# EAGLE design 00C-001 (EAGLE 6.3)
CIRCUIT_CATEGORY: CATEGORY; CIRCUIT_NAME: NAME

## Sheet 1 of 4
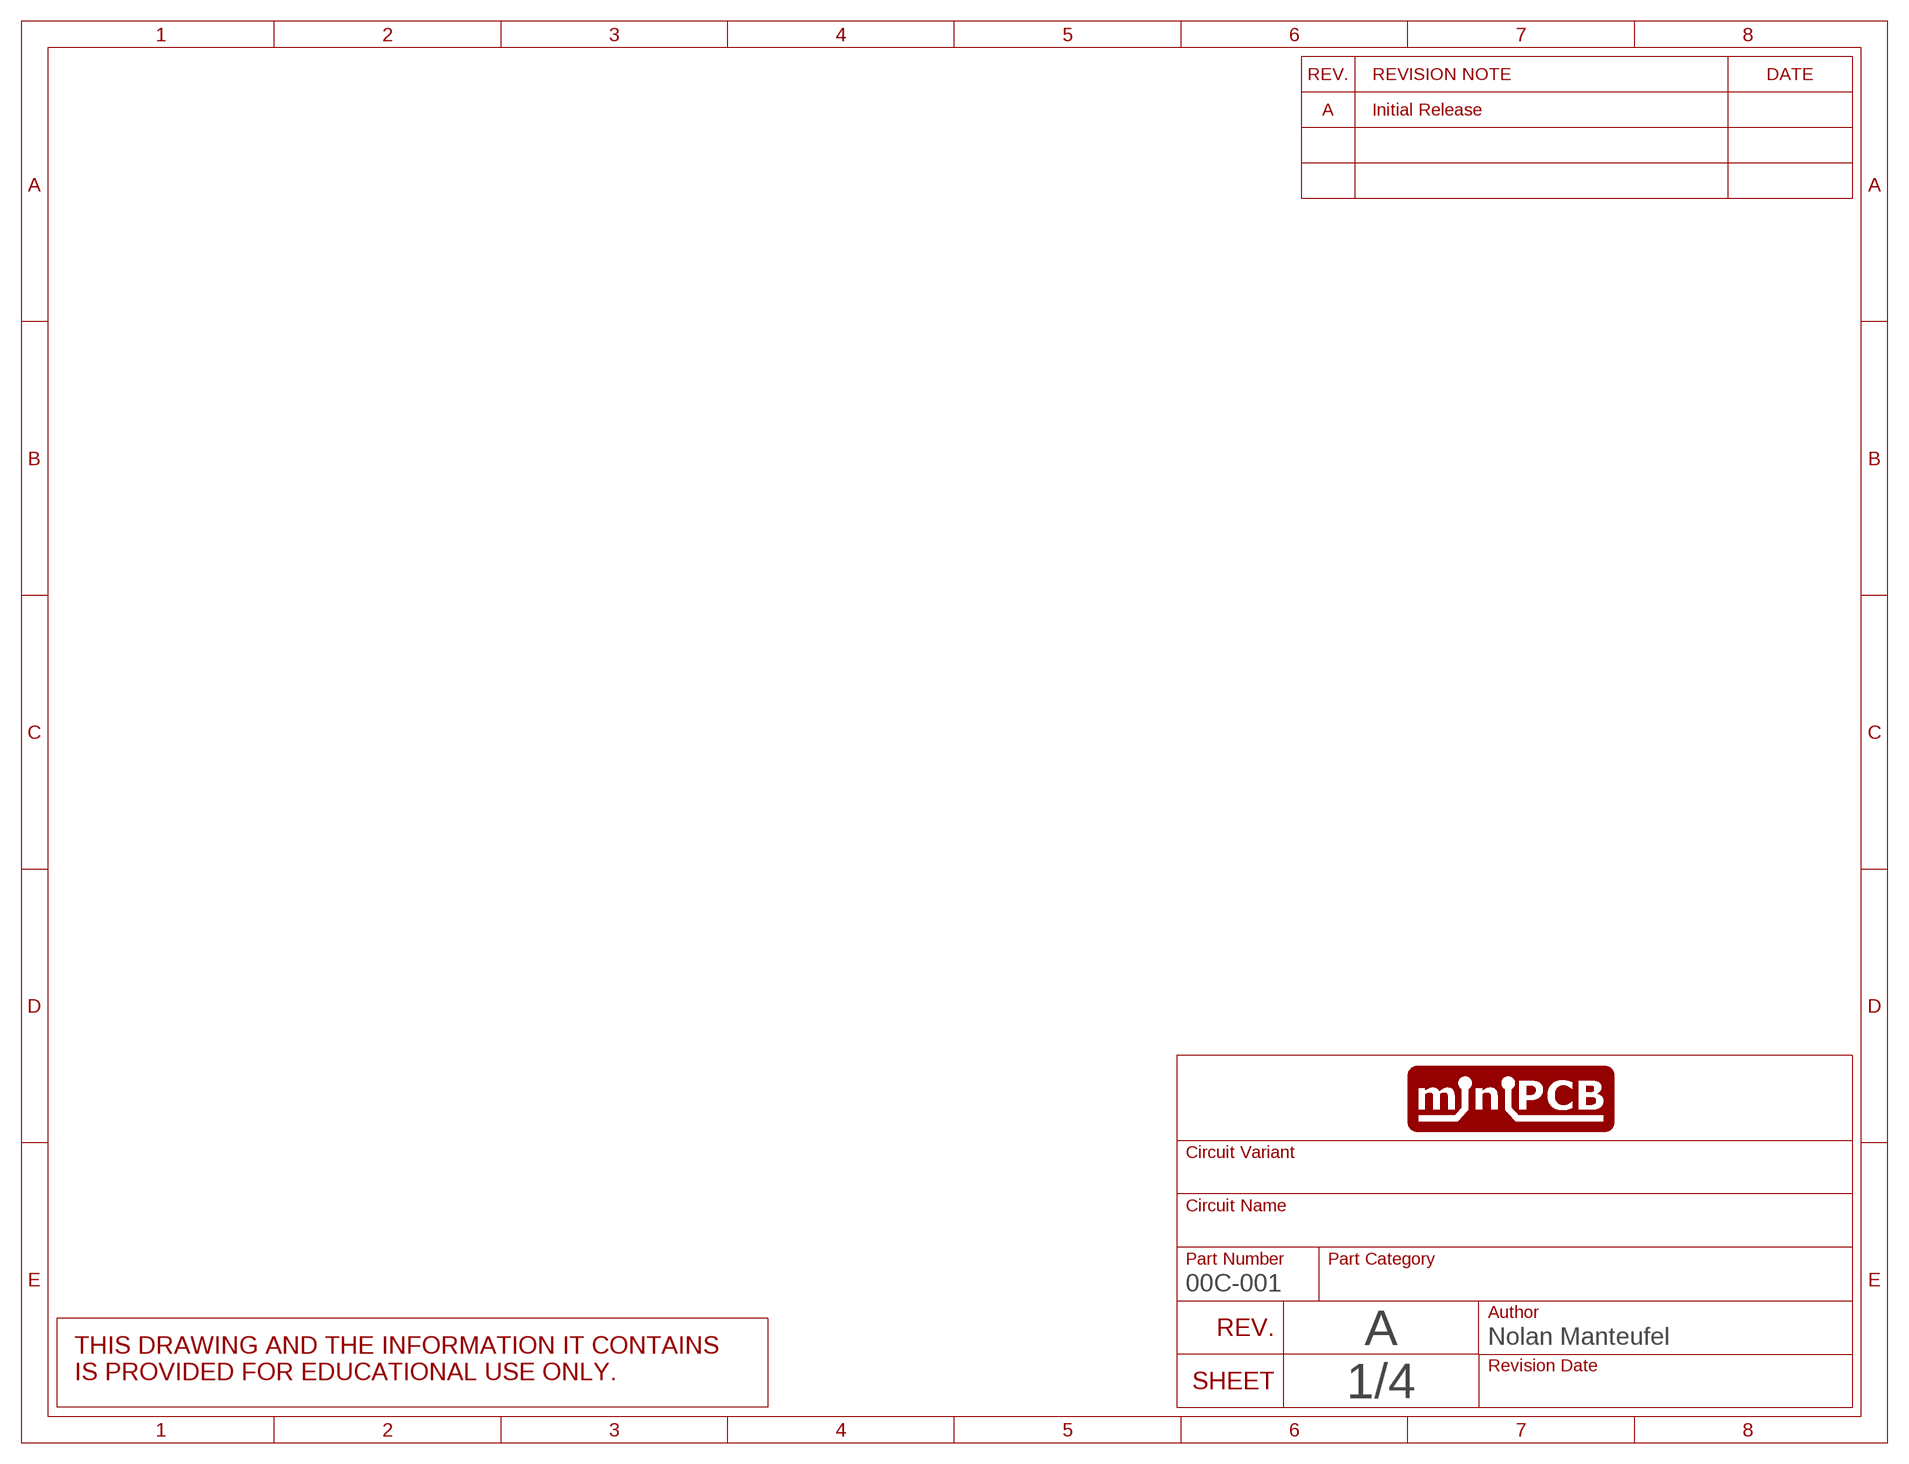
[diagram p0: schematic, sheet 1]
SHEET1 (SCHEMATIC): REVISION: A

## Sheet 2 of 4
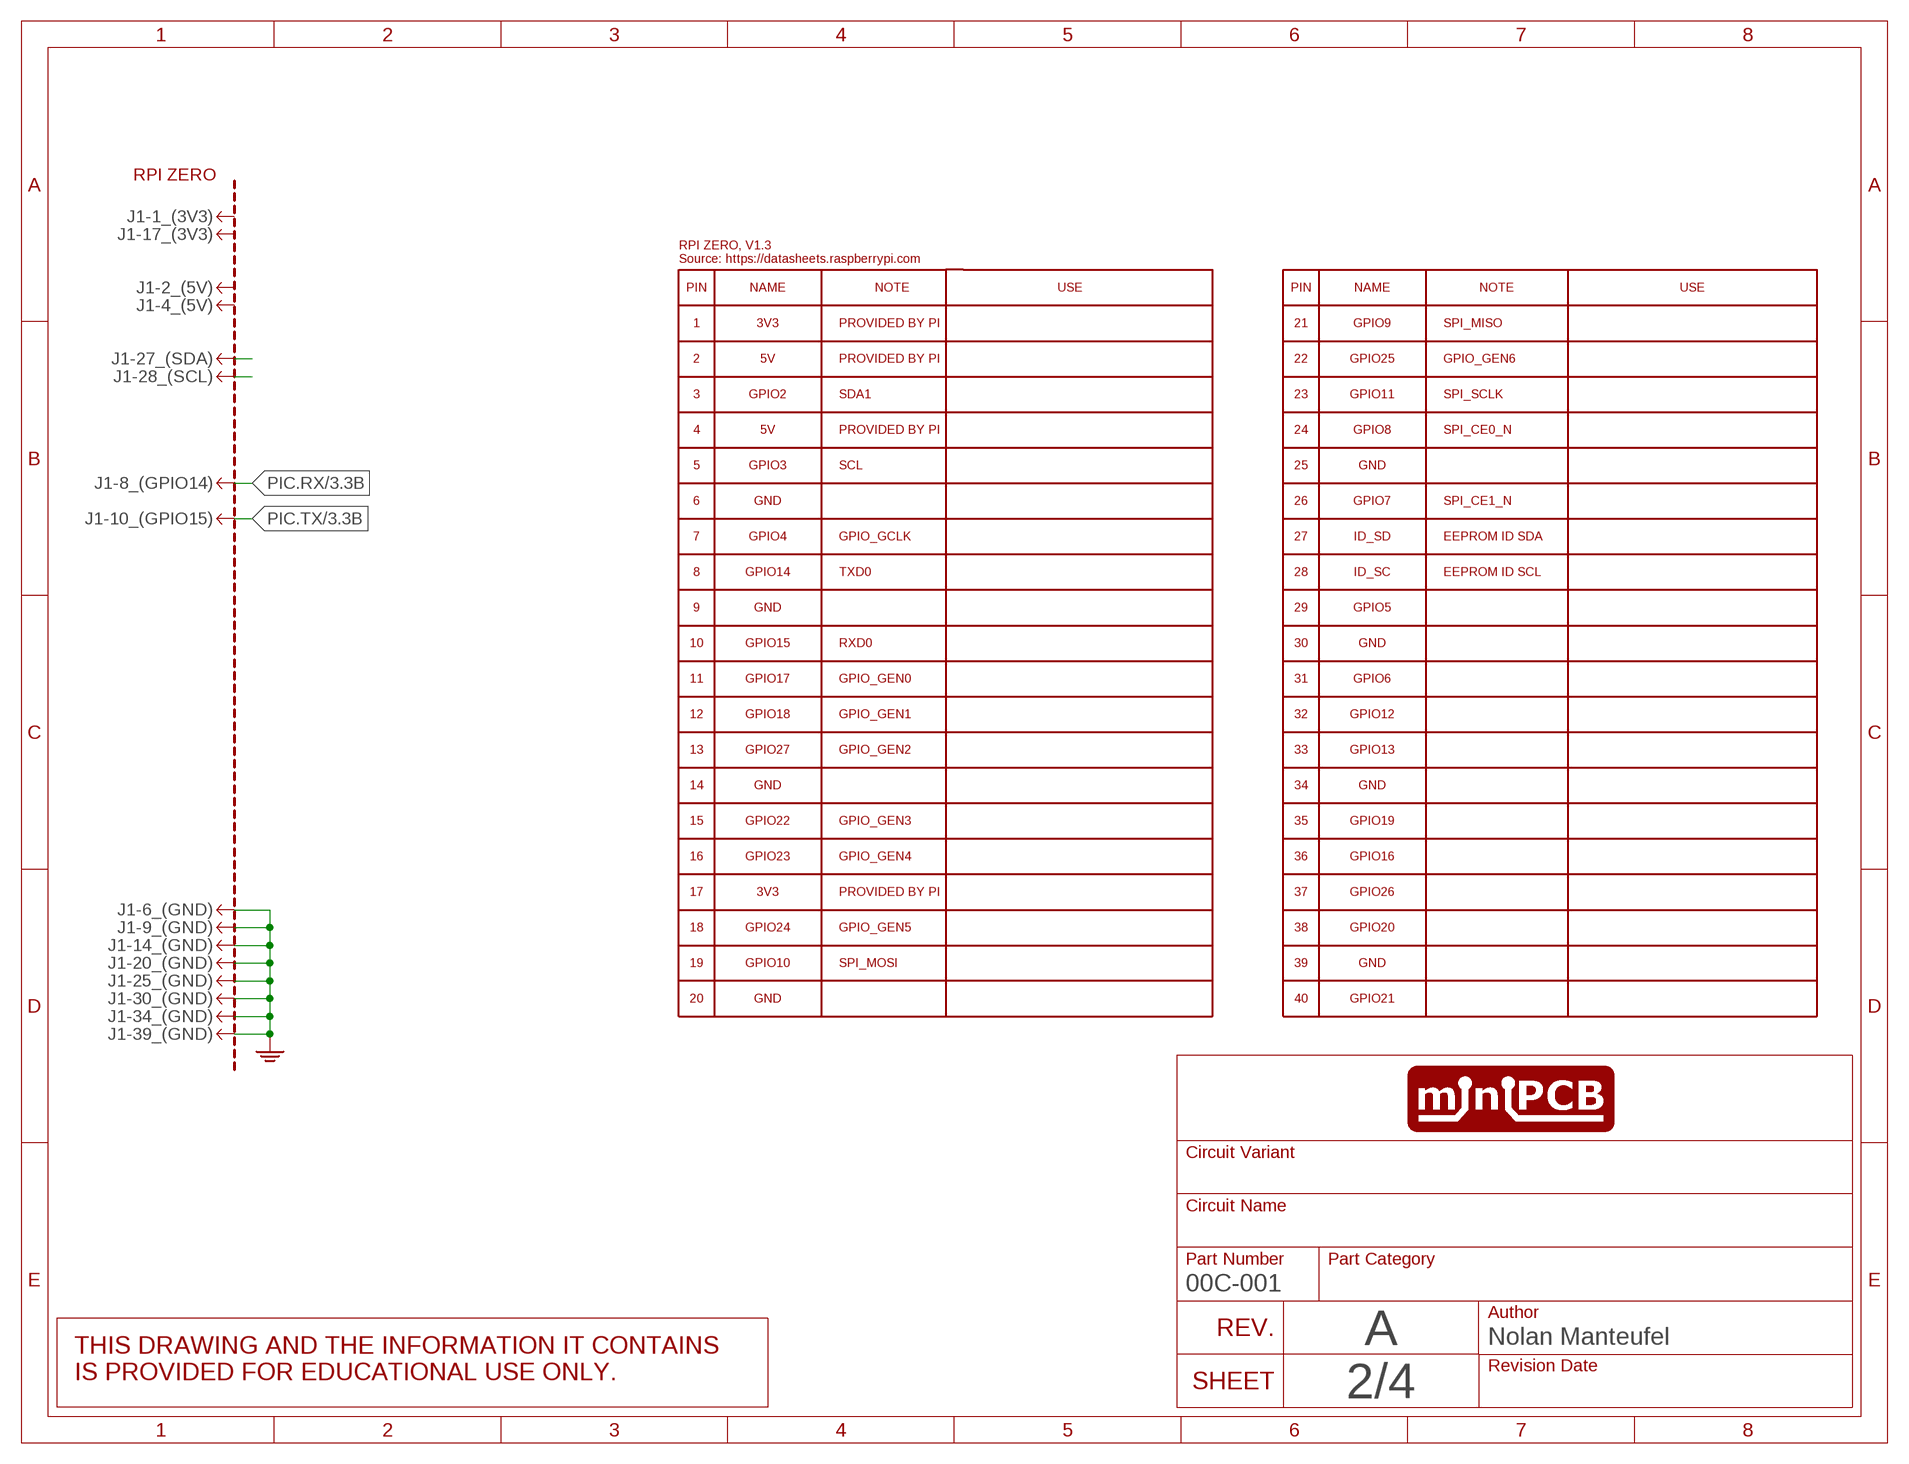
[diagram p1: schematic, sheet 2]
SHEET2 (SCHEMATIC): REVISION: A

### Parts
J1-  RPI ZERO  RPI_ZERO  [RPI_ZERO]

### Nets
GND: J1-.6 J1-.9 J1-.14 J1-.20 J1-.25 J1-.30 J1-.34 J1-.39 ; also sheet 3,4
N$1: J1-.27
N$4: J1-.28
PIC.RX: J1-.8 ; also sheet 3
PIC.TX: J1-.10 ; also sheet 3
Unconnected: J1-.1 J1-.2 J1-.3 J1-.4 J1-.5 J1-.7 J1-.11 J1-.12 J1-.13 J1-.15 J1-.16 J1-.17 J1-.18 J1-.19 J1-.21 J1-.22 J1-.23 J1-.24 J1-.26 J1-.29 J1-.31 J1-.32 J1-.33 J1-.35 J1-.36 J1-.37 J1-.38 J1-.40

## Sheet 3 of 4
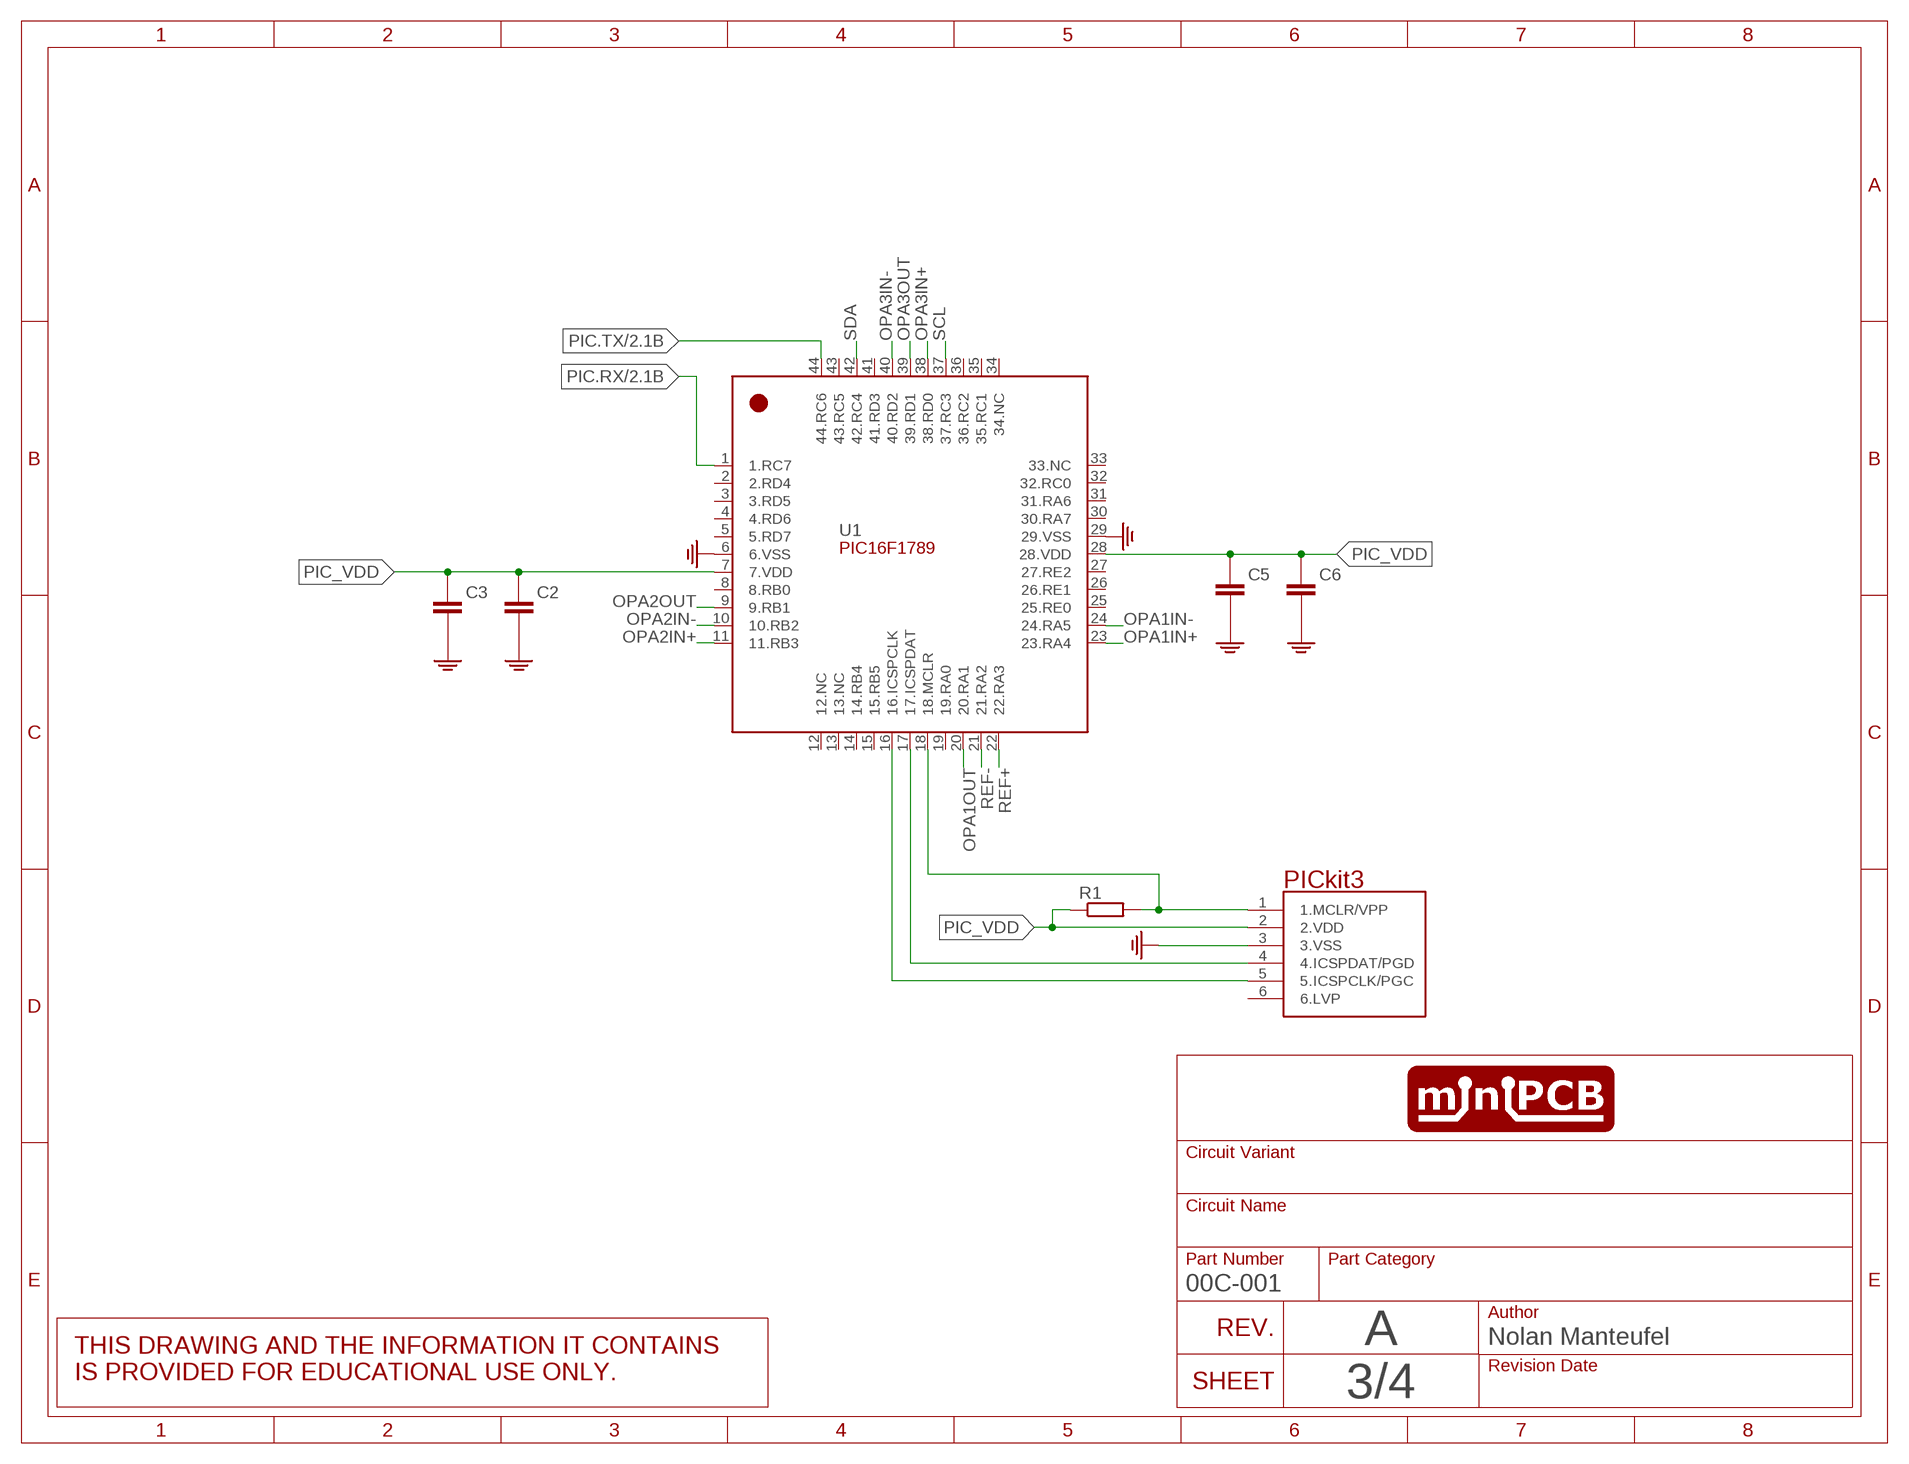
[diagram p2: schematic, sheet 3]
SHEET3 (SCHEMATIC): REVISION: A

### Parts
C2  CAPACITORSMD  [C0805]
C3  CAPACITORSMD  [C0805]
C5  CAPACITORSMD  [C0805]
C6  CAPACITORSMD  [C0805]
R1  RESISTORSMD  [R0805]
U1  PIC16F1789  [SQFP-S-10X10-44]
U$401  PICKIT3  [PINS_6_PICKIT3]

### Nets
GND: C2.2(-) C3.2(-) C5.2(-) C6.2(-) U1.6(6.VSS) U1.29(29.VSS) U$401.3(3.VSS) ; also sheet 2,4
N$8: U1.17(17.ICSPDAT) U$401.4(4.ICSPDAT/PGD)
N$23: U1.16(16.ICSPCLK) U$401.5(5.ICSPCLK/PGC)
N$24: R1.2 U1.18(18.MCLR) U$401.1(1.MCLR/VPP)
OPA1IN+: U1.23(23.RA4)
OPA1IN-: U1.24(24.RA5)
OPA1OUT: U1.20(20.RA1)
OPA2IN+: U1.11(11.RB3)
OPA2IN-: U1.10(10.RB2)
OPA2OUT: U1.9(9.RB1)
OPA3IN+: U1.38(38.RD0)
OPA3IN-: U1.40(40.RD2)
OPA3OUT: U1.39(39.RD1)
PIC.RX: U1.1(1.RC7) ; also sheet 2
PIC.TX: U1.44(44.RC6) ; also sheet 2
PIC_VDD: C2.1(+) C3.1(+) C5.1(+) C6.1(+) R1.1 U1.7(7.VDD) U1.28(28.VDD) U$401.2(2.VDD)
REF+: U1.22(22.RA3)
REF-: U1.21(21.RA2)
SCL: U1.37(37.RC3)
SDA: U1.42(42.RC4)
Unconnected: U1.2(2.RD4) U1.3(3.RD5) U1.4(4.RD6) U1.5(5.RD7) U1.8(8.RB0) U1.12(12.NC) U1.13(13.NC) U1.14(14.RB4) U1.15(15.RB5) U1.19(19.RA0) U1.25(25.RE0) U1.26(26.RE1) U1.27(27.RE2) U1.30(30.RA7) U1.31(31.RA6) U1.32(32.RC0) U1.33(33.NC) U1.34(34.NC) U1.35(35.RC1) U1.36(36.RC2) U1.41(41.RD3) U1.43(43.RC5) U$401.6(6.LVP)

## Sheet 4 of 4
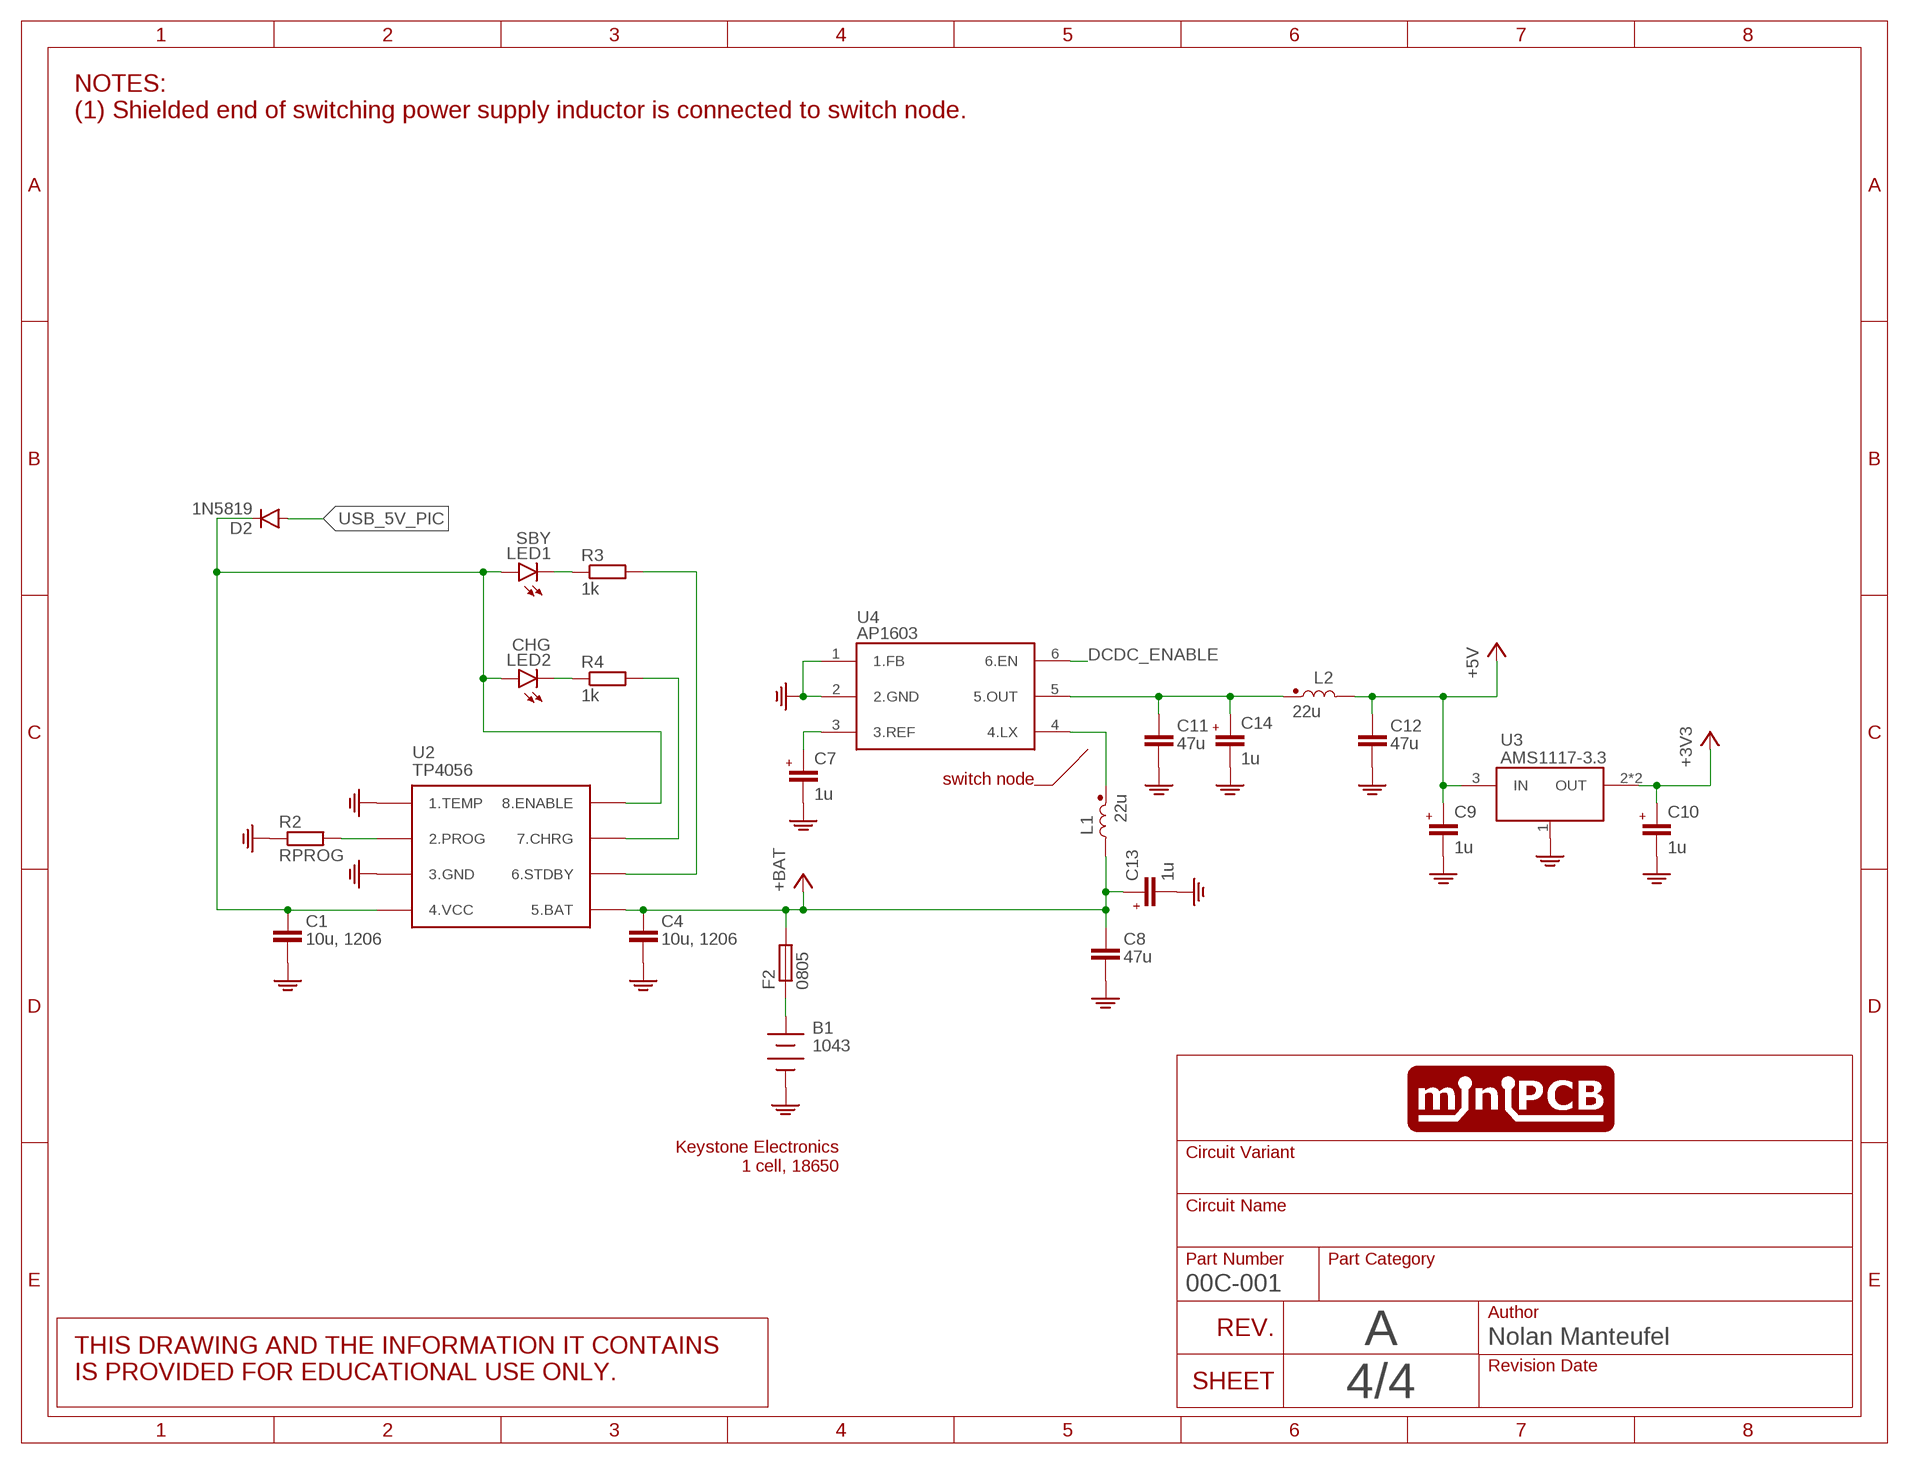
[diagram p3: schematic, sheet 4]
SHEET4 (SCHEMATIC): REVISION: A

### Parts
B1  1043  BATTERY18650  [BATTERY-18650-1]
C1  10u, 1206  C-EUC1206  [C1206]
C4  10u, 1206  C-EUC1206  [C1206]
C7  1u  C0805  [C0805]
C8  47u  C-EU865080642006  [C-WE-5MM]
C9  1u  C0805  [C0805]
C10  1u  C0805  [C0805]
C11  47u  C-EU865080642006  [C-WE-5MM]
C12  47u  C-EU865080642006  [C-WE-5MM]
C13  1u  C0805  [C0805]
C14  1u  C0805  [C0805]
D2  1N5819  DIODE-SOD80C  [SOD80C]
F2  0805  FUSE0805  [F0805]
L1  22u  L5040  [SRN5040]
L2  22u  L5040  [SRN5040]
LED1  SBY  LEDCHIPLED_0603  [CHIPLED_0603]
LED2  CHG  LEDCHIPLED_0603  [CHIPLED_0603]
R2  RPROG  R-EU__R0805  [R0805]
R3  1k  R-EU__R0805  [R0805]
R4  1k  R-EU__R0805  [R0805]
U2  TP4056  [SO08-THERMAL]
U3  AMS1117-3.3  REGULATOR_SCHLM1117  [SOT223]
U4  AP1603  [SOT23-6]

### Nets
+3V3: C10.2(+) U3.2(OUT) U3.4.TAB(OUT)
+5V: C9.2(+) C12.1+ L2.1 U3.3(IN)
+BAT: C4.+ C8.1+ C13.2(+) F2.2 L1.1 U2.5(5.BAT)
B+: B1.+ F2.1
CHARGE: R4.2 U2.7(7.CHRG)
DCDC_ENABLE: U4.6(6.EN)
DCDC_OUT: C11.1+ C14.2(+) L2.2 U4.5(5.OUT)
DCDC_REF: C7.2(+) U4.3(3.REF)
GND: B1.1(-) C1.- C4.- C7.1(-) C8.2- C9.1(-) C10.1(-) C11.2- C12.2- C13.1(-) C14.1(-) R2.1 U2.1(1.TEMP) U2.3(3.GND) U2.THERMAL(3.GND) U3.1(GND) U4.1(1.FB) U4.2(2.GND) ; also sheet 2,3
N$2: LED1.C R3.1
N$3: LED2.C R4.1
N$7: R2.2 U2.2(2.PROG)
STANDBY: R3.2 U2.6(6.STDBY)
SWITCH_NODE: L1.2 U4.4(4.LX)
USB_5V_PIC: D2.A
VCC: C1.+ D2.C LED1.A LED2.A U2.4(4.VCC) U2.8(8.ENABLE)

### Notes on the sheet
- NOTES:
  (1) Shielded end of switching power supply inductor is connected to switch node.
- switch node
- Keystone Electronics
  1 cell, 18650

## Library data of the parts
B1 = utsa:BATTERY: 2xAAA battery holder for VIVA
C1 C4 C8 C11 C12 = utsa:C-EU: CAPACITOR, European symbol
C2 C3 C5 C6 = minipcb:CAPACITOR
C7 C9 C10 C13 C14 = utsa:C
D2 = utsa:DIODE-: DIODE
F2 = utsa:FUSE
J1- = minipcb:RPI_ZERO
L1 L2 = utsa:L
LED1 LED2 = utsa:LED: LED OSRAM: - CHIPLED LG R971, LG N971, LY N971, LG Q971, LY Q971, LO R971, LY R971 LH N974, LH R974 LS Q976, LO Q976, LY Q976 LO Q996 - Hyper CHIPLED LW Q18S LB Q993, LB Q99A, LB R99A - SideLED LS A670, LO A670, LY A670, LG A670, LP A670 LB A673, LV A673, LT A673, LW A673 LH A674 LY A675 LS A676, LA A676, LO A676, LY A676, LW A676 LS A679, LY A679, LG A679 - Hyper Micro SIDELED® LS Y876, LA Y876, LO Y876, LY Y876 LT Y87S - SmartLED LW L88C, LW L88S LB L89C, LB L89S, LG L890 LS L89K, LO L89K, LY L89K LS L896, LA L896, LO L896, LY L896 - TOPLED LS T670, LO T670, LY T670, LG T670, LP T670 LSG T670, LSP T670, LSY T670, LOP T670, LYG T670 LG T671, LOG T671, LSG T671 LB T673, LV T673, LT T673, LW T673 LH T674 LS T676, LA T676, LO T676, LY T676, LB T676, LH T676, LSB T676, LW T676 LB T67C, LV T67C, LT T67C, LS T67K, LO T67K, LY T67K, LW E67C LS E67B, LA E67B, LO E67B, LY E67B, LB E67C, LV E67C, LT E67C LW T67C LS T679, LY T679, LG T679 LS T770, LO T770, LY T770, LG T770, LP T770 LB T773, LV T773, LT T773, LW T773 LH T774 LS E675, LA E675, LY E675, LS T675 LS T776, LA T776, LO T776, LY T776, LB T776 LHGB T686 LT T68C, LB T68C - Hyper Mini TOPLED® LB M676 - Mini TOPLED Santana® LG M470 LS M47K, LO M47K, LY M47K Source: http://www.osram.convergy.de LUXEON: - LUMILED® LXK2-PW12-R00, LXK2-PW12-S00, LXK2-PW14-U00, LXK2-PW14-V00 LXK2-PM12-R00, LXK2-PM12-S00, LXK2-PM14-U00 LXK2-PE12-Q00, LXK2-PE12-R00, LXK2-PE12-S00, LXK2-PE14-T00, LXK2-PE14-U00 LXK2-PB12-K00, LXK2-PB12-L00, LXK2-PB12-M00, LXK2-PB14-N00, LXK2-PB14-P00, LXK2-PB14-Q00 LXK2-PR12-L00, LXK2-PR12-M00, LXK2-PR14-Q00, LXK2-PR14-R00 LXK2-PD12-Q00, LXK2-PD12-R00, LXK2-PD12-S00 LXK2-PH12-R00, LXK2-PH12-S00 LXK2-PL12-P00, LXK2-PL12-Q00, LXK2-PL12-R00 Source: www.luxeon.com KINGBRIGHT: KA-3528ASYC Source: www.kingbright.com
R1 = minipcb:RESISTOR
R2-R4 = utsa:R-EU_: RESISTOR, European symbol
U1 = minipcb:PIC16F1789
U2 = utsa:TP4056
U3 = utsa:REGULATOR_SCH: Linear Regulator in SOT-223 package. NOTE: select correct pinout for your application. Tab may be OUT or GND!
U4 = utsa:AP1603: STEP-UP DC-DC CONVERTER
U$401 = nolan-utsa:PICKIT3

## Board
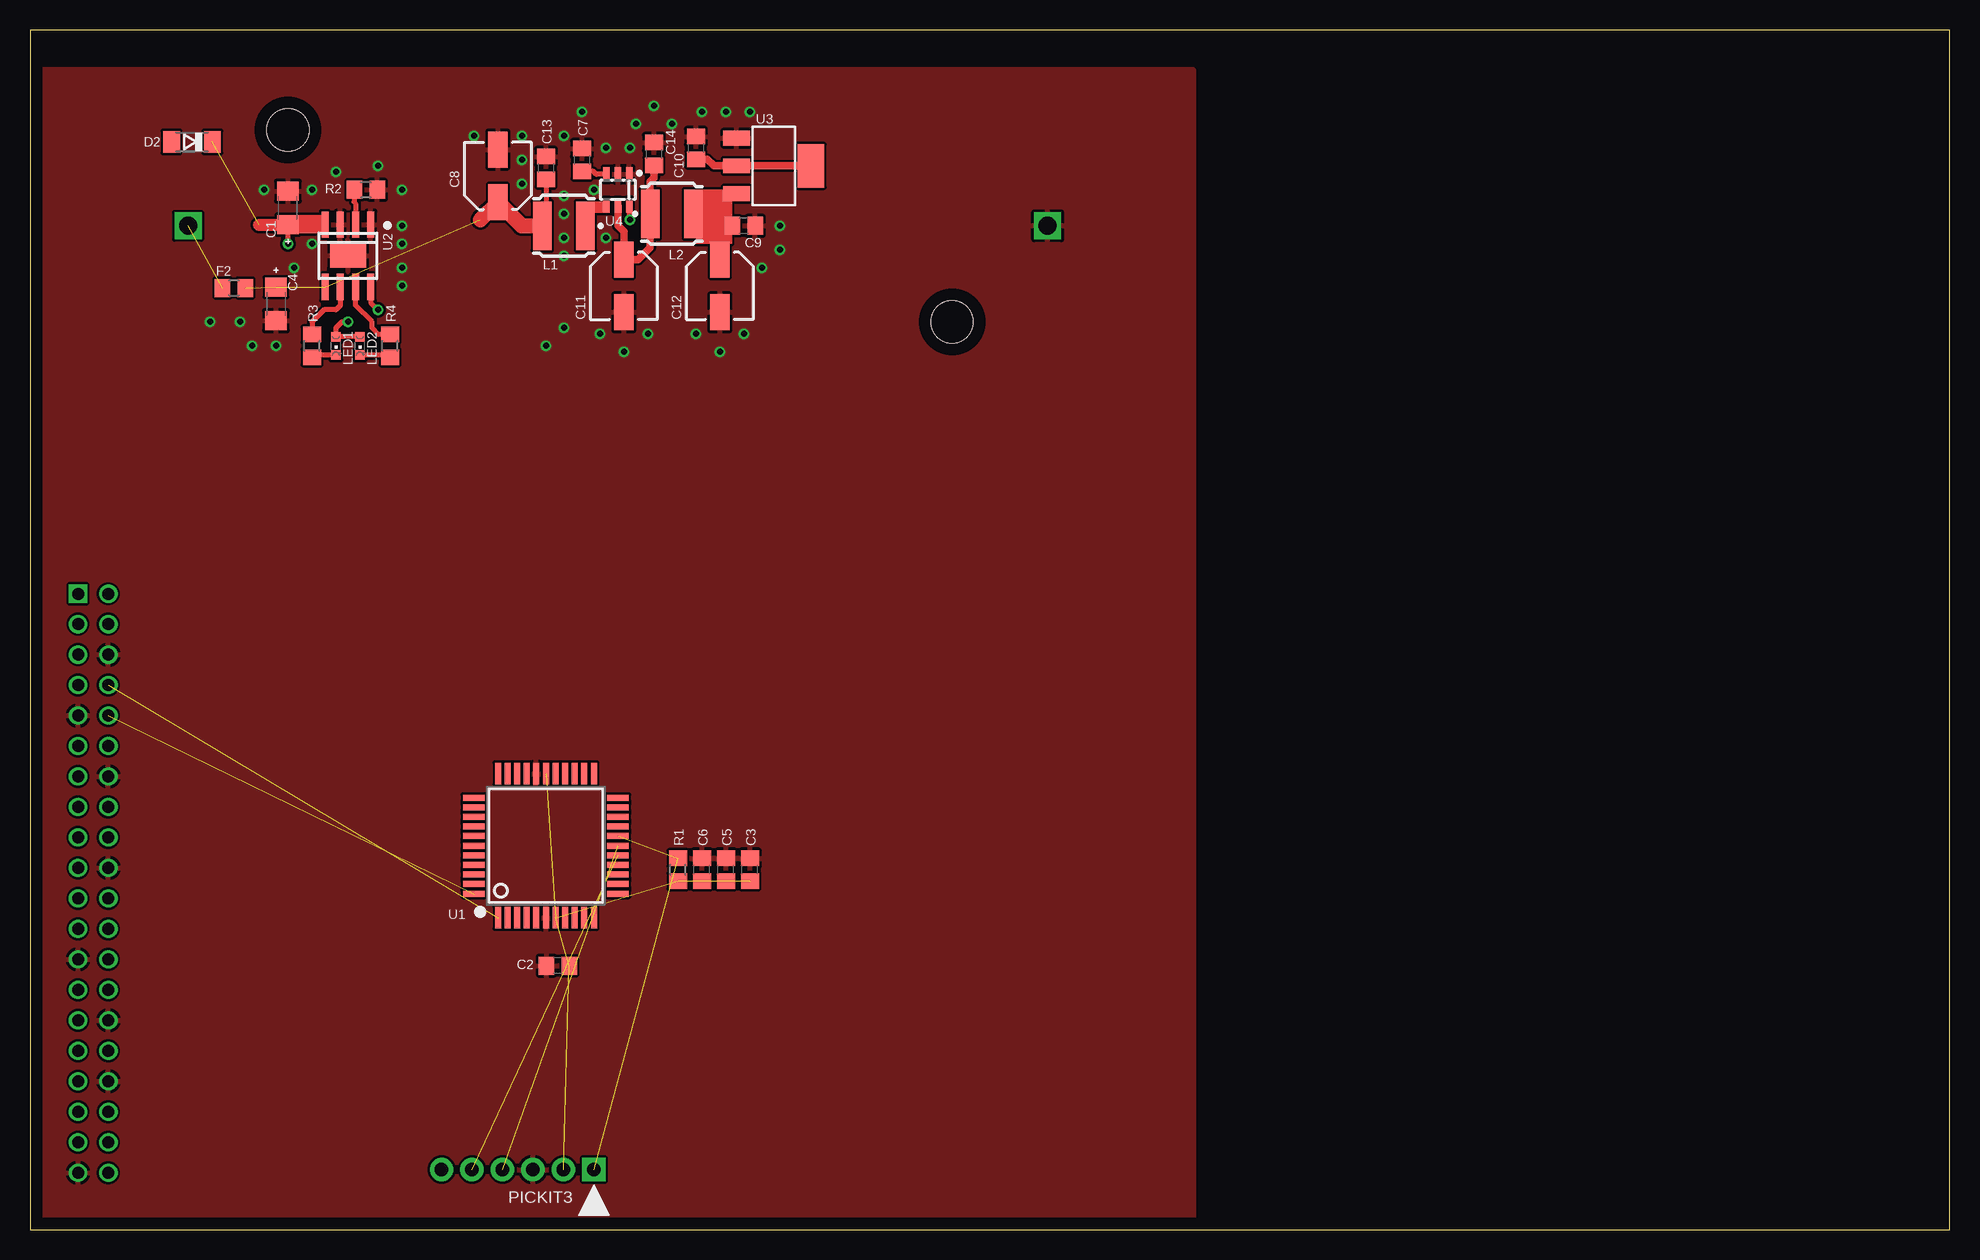
[diagram p4: board, top side]
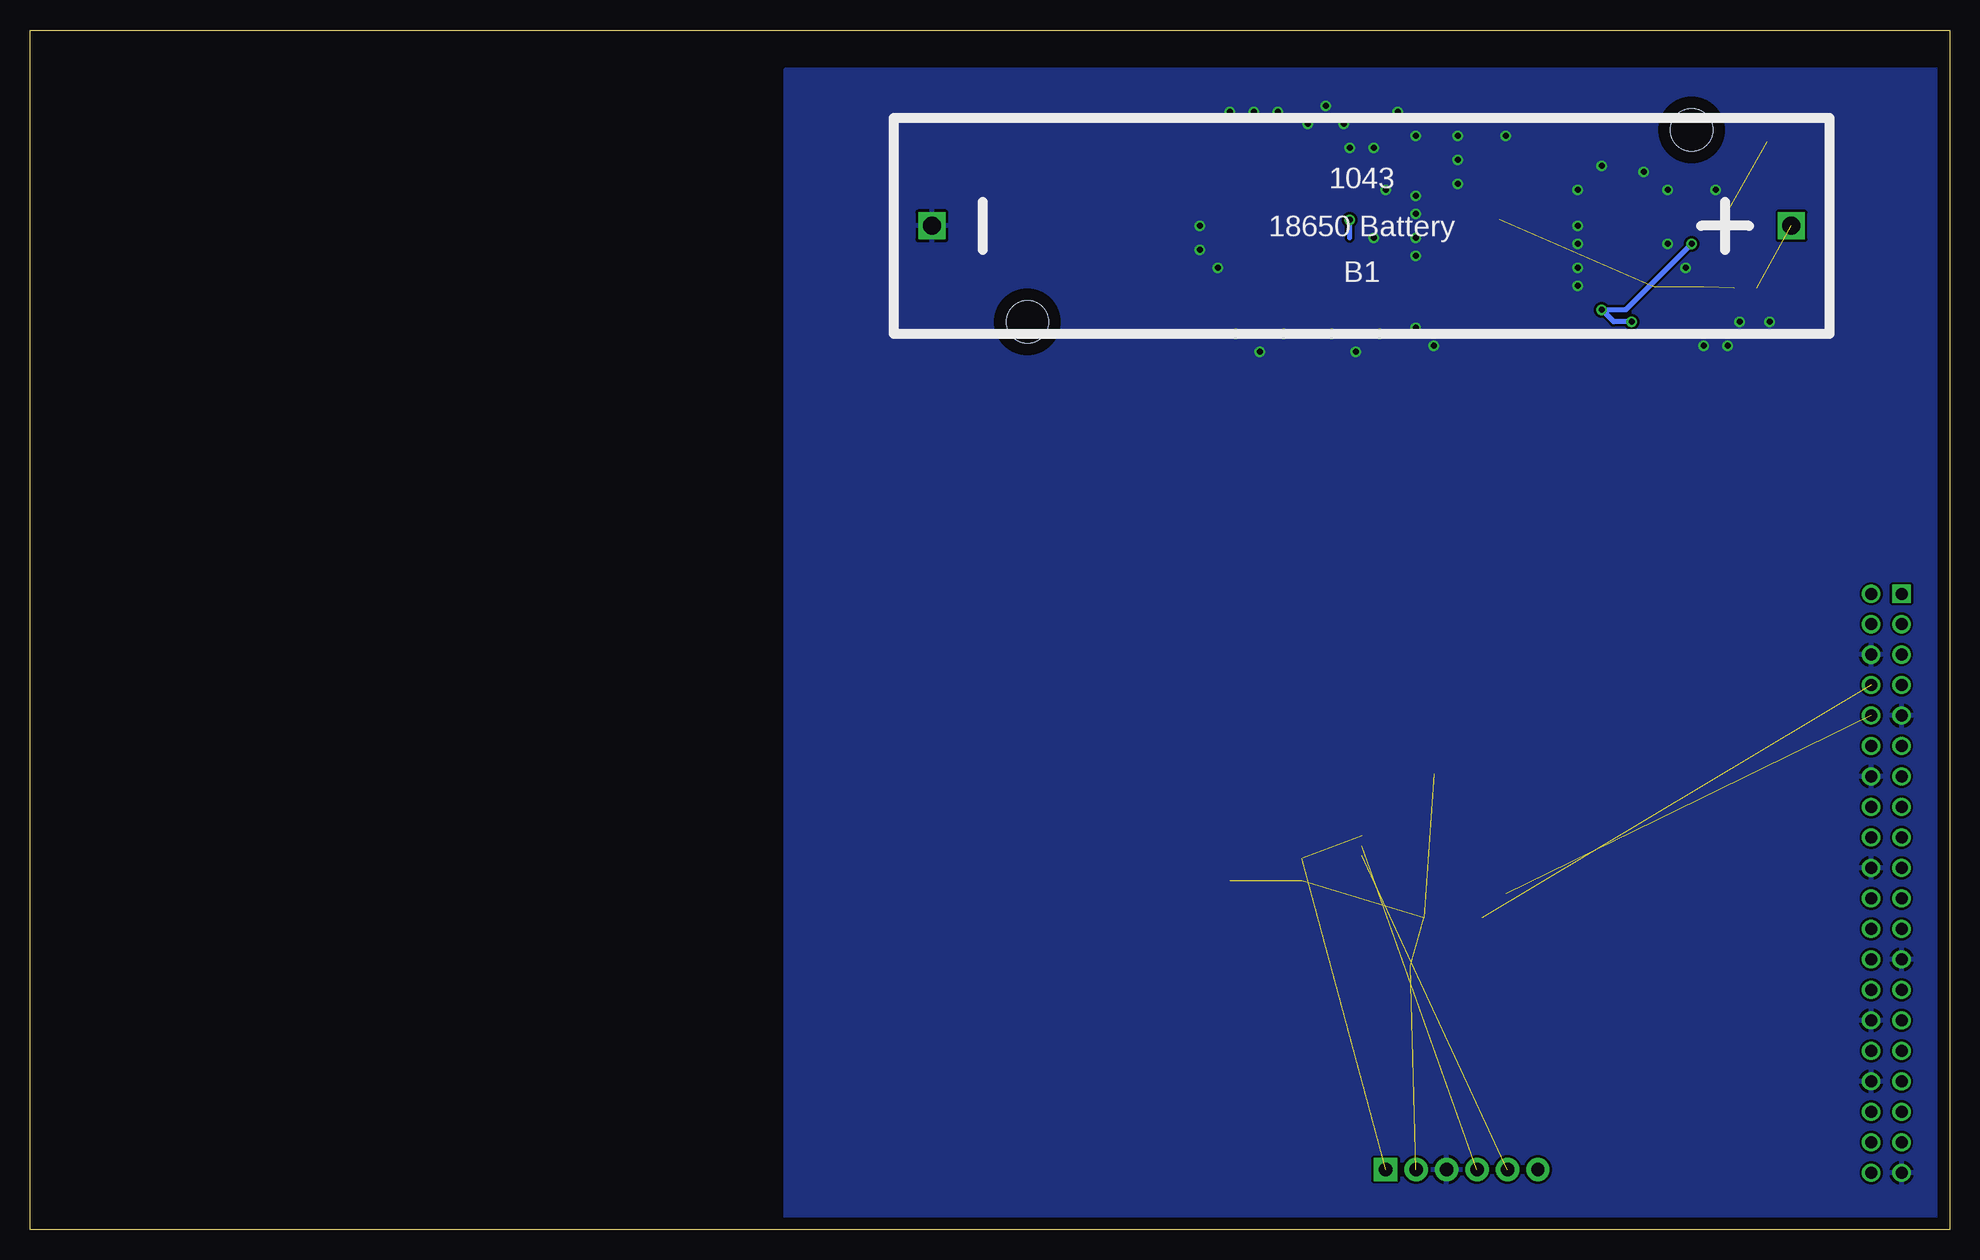
[diagram p5: board, bottom side, seen from below]

Size 160 x 100 mm. Coordinates in mm from the lower left corner, seen from the top.
Outline: 0,0 160,0 160,100 0,100 0,0
Copper layers (1*16): Top 0.035mm / dielectric 1.5mm / Bottom 0.035mm
Design rules "default": minimum track width 10mil, minimum drill 24mil, track to track 8mil, track to pad 8mil, pad to pad 8mil, via to via 8mil, smd to smd 8mil, copper to edge 40mil, drill to drill 8mil, minimum pad ring 10mil, minimum via ring 8mil, stop-mask expansion 4mil, vias tented up to drill 0mil, thermal gap 10mil

### Footprints (pad centres in the part's own frame; a part is rotated, then mirrored left to right if it is on the bottom)
BATTERY-18650-1 = drill 1.5 square: 1 35.82,0; + -35.82,0 | hole 3.5: -27.5,-8; 27.86,8
C1206 = smd 1.6 x 1.8: + -1.4,0; - 1.4,0
C0805 = smd 1.3 x 1.5: 1 -0.95,0; 2 0.95,0
C-WE-5MM = smd 1.6 x 3: 1+ 0,2.2; 2- 0,-2.2
SOD80C = smd 1.4 x 1.8: A 1.7,0; C -1.7,0
F0805 = smd 1.3 x 1.5: 1 -0.95,0; 2 0.95,0
RPI_ZERO = drill 1 square: 1 0,0 | drill 1: 2 2.54,0; 3 0,-2.54; 4 2.54,-2.54; 5 0,-5.08; 6 2.54,-5.08; 7 0,-7.62; 8 2.54,-7.62; 9 0,-10.16; 10 2.54,-10.16; 11 0,-12.7; 12 2.54,-12.7; 13 0,-15.24; 14 2.54,-15.24; 15 0,-17.78; 16 2.54,-17.78; 17 0,-20.32; 18 2.54,-20.32; 19 0,-22.86; 20 2.54,-22.86; 21 0,-25.4; 22 2.54,-25.4; 23 0,-27.94; 24 2.54,-27.94; 25 0,-30.48; 26 2.54,-30.48; 27 0,-33.02; 28 2.54,-33.02; 29 0,-35.56; 30 2.54,-35.56; 31 0,-38.1; 32 2.54,-38.1; 33 0,-40.64; 34 2.54,-40.64; 35 0,-43.18; 36 2.54,-43.18; 37 0,-45.72; 38 2.54,-45.72; 39 0,-48.26; 40 2.54,-48.26
SRN5040 = smd 1.524 x 4.064: 1 -1.803,0; 2 1.803,0
CHIPLED_0603 = smd 0.8 x 0.8: A 0,-0.75; C 0,0.75
R0805 = smd 1.3 x 1.5: 1 -0.95,0; 2 0.95,0
SQFP-S-10X10-44 = smd 0.5 x 1.8: 1 -4,-6; 2 -3.2,-6; 3 -2.4,-6; 4 -1.6,-6; 5 -0.8,-6; 6 0,-6; 7 0.8,-6; 8 1.6,-6; 9 2.4,-6; 10 3.2,-6; 11 4,-6; 23 4,6; 24 3.2,6; 25 2.4,6; 26 1.6,6; 27 0.8,6; 28 0,6; 29 -0.8,6; 30 -1.6,6; 31 -2.4,6; 32 -3.2,6; 33 -4,6 | smd 1.8 x 0.5: 12 6,-4; 13 6,-3.2; 14 6,-2.4; 15 6,-1.6; 16 6,-0.8; 17 6,0; 18 6,0.8; 19 6,1.6; 20 6,2.4; 21 6,3.2; 22 6,4; 34 -6,4; 35 -6,3.2; 36 -6,2.4; 37 -6,1.6; 38 -6,0.8; 39 -6,0; 40 -6,-0.8; 41 -6,-1.6; 42 -6,-2.4; 43 -6,-3.2; 44 -6,-4
SO08-THERMAL = smd 0.6 x 2.2: 1 -1.905,-2.6; 2 -0.635,-2.6; 3 0.635,-2.6; 4 1.905,-2.6; 5 1.905,2.6; 6 0.635,2.6; 7 -0.635,2.6; 8 -1.905,2.6 | smd 3 x 2: THERMAL 0,0
SOT223 = smd 1.219 x 2.235: 1 -2.311,-3.099; 2 0,-3.099; 3 2.311,-3.099 | smd 3.6 x 2.2: 4.TAB 0,3.099
SOT23-6 = smd 0.55 x 1.2: 1 -0.95,-1.3; 2 0,-1.3; 3 0.95,-1.3; 4 0.95,1.3; 5 0,1.3; 6 -0.95,1.3
PINS_6_PICKIT3 = drill 1.1 pad 1.93 square: 1 0,0 | drill 1.1 pad 1.93: 2 0,-2.54; 3 0,-5.08; 4 0,-7.62; 5 0,-10.16; 6 0,-12.7

### Placement (x,y rotation side)
B1  49,83.67 180 bottom
C1  21.5,85.17 90 top
C2  44,22 180 top
C3  60,30 90 top
C4  20.5,77.17 270 top
C5  58,30 90 top
C6  56,30 90 top
C7  46,89.17 270 top
C8  39,87.83 180 top
C9  59.5,83.67 180 top
C10  55.5,90.17 270 top
C11  49.5,78.67 0 top
C12  57.5,78.67 0 top
C13  43,88.5 270 top
C14  52,89.67 270 top
D2  13.5,90.67 180 top
F2  17,78.5 0 top
J1-  4,53 0 top
L1  44.5,83.67 0 top
L2  53.5,84.67 180 top
LED1  25.5,73.67 180 top
LED2  27.5,73.67 180 top
R1  54,30 90 top
R2  28,86.67 180 top
R3  23.5,73.67 90 top
R4  30,73.67 90 top
U1  43,32 0 top
U2  26.5,81.17 180 top
U3  62,88.67 270 top
U4  49,86.67 180 top
U$401  47,5 270 top

### Tracks (layer width: path | path; a pad name or v marks a point on that pad's centre or on a via)
+3V3
  Top 0.61: C10.2 56.45,89.22 57,88.67 U3.2 U3.4.TAB
+5V
  Top 0.61: L2.1 57.5,82.47 C12.1+ | C9.2 57.5,84.17 57,84.67 L2.1 | U3.3 57.69,86.36 56,84.67 L2.1
+BAT  (3 unrouted)
  Top 0.406: C13.2 43,83.97 L1.1
  Top 1.27: 37.54,84.17 C8.1+ 40.96,83.67 L1.1
B+  (1 unrouted)
CHARGE
  Top 0.406: R4.2 29.05,74.62 28.5,75.17 28.5,75.67 27.14,77.03 U2.7
DCDC_ENABLE  (via drill 0.5)
  Top 0.406: U4.6 49.95,84.22 v50,84.17
  Bottom 0.406: 50,82.67 v50,84.17
DCDC_OUT
  Top 0.61: U4.5 49,83.67 49.5,83.17 C11.1+ 50.7,80.87 51.7,81.87 L2.2 51.7,87.37 52,87.67 C14.2
DCDC_REF
  Top 0.406: U4.3 47.2,87.97 46.95,88.22 C7.2
GND  (via drill 0.5)
  other vias: 22,80.17 23.5,82.17 31,78.67 31,80.17 31,82.17 31,83.67 20.5,73.67 23.5,86.67 19.5,86.67 25.5,88.17 29,88.67 31,86.67 41,87.17 41,89.17 44.5,81.17 47.5,74.67 49.5,73.17 51.5,74.67 55.5,74.67 57.5,73.17 59.5,74.67 37,91.17 41,91.17 44.5,91.17 48,90.17 50,90.17 50.5,92.17 53.5,92.17 58,93.17 60,93.17 56,93.17 62.5,83.67 62.5,81.67 61,80.17 44.5,84.67 44.5,82.67 48,82.67 47,86.67 44.5,86.17 43,73.67 44.5,75.17 18.5,73.67 17.5,75.67 15,75.67 46,93.17 52,93.67
  pour Top: 1,0.67 97,0.67 97,96.67 1,96.67
  pour Bottom: 1,0.67 97,0.67 97,96.67 1,96.67
N$2
  Top 0.406: R3.1 23.7,72.92 LED1.C
N$3
  Top 0.406: LED2.C 29.8,72.92 arc-90 R4.1
N$7
  Top 0.406: R2.2 27,86.62 27,85.67 27.14,85.53 U2.2
N$8  (1 unrouted)
N$23  (1 unrouted)
N$24  (2 unrouted)
PIC.RX  (1 unrouted)
PIC.TX  (1 unrouted)
PIC_VDD  (7 unrouted)
STANDBY
  Top 0.406: U2.6 25.86,77.03 25.5,76.67 24.5,76.67 23.5,75.67 R3.2
SWITCH_NODE
  Top 0.406: U4.4 47,85.37 46.5,84.87 L1.2
VCC  (via drill 0.5)  (1 unrouted)
  Top 0.406: U2.8 28.41,77.27 v29,76.67 | v21.5,82.17 C1.+ U2.4 | LED2.A LED1.A 25.5,75.17 26,75.67 v26.5,75.67
  Top 1.016: 19.1,83.77 C1.+
  Bottom 0.406: v21.5,82.17 27,76.67 v29,76.67 28,75.67 v26.5,75.67
(copper drawn outside any net)
  shapes: Top area x3